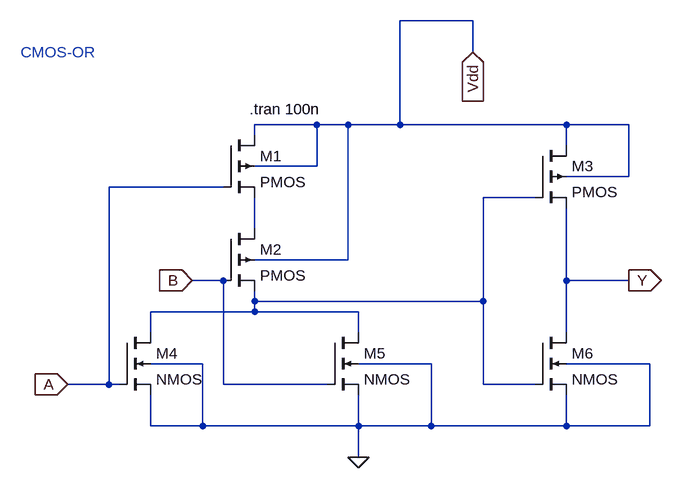
[diagram p0: schematic CMOS_or.asc]
CMOS_or.asc, the LTspice schematic file:
Version 4
SHEET 1 992 680
WIRE 656 -48 544 -48
WIRE 656 0 656 -48
WIRE 416 112 320 112
WIRE 464 112 416 112
WIRE 544 112 544 -48
WIRE 544 112 464 112
WIRE 800 112 544 112
WIRE 896 112 800 112
WIRE 320 128 320 112
WIRE 800 144 800 112
WIRE 416 176 416 112
WIRE 416 176 320 176
WIRE 896 192 896 112
WIRE 896 192 800 192
WIRE 272 208 96 208
WIRE 752 224 672 224
WIRE 320 272 320 224
WIRE 464 320 464 112
WIRE 464 320 320 320
WIRE 272 352 224 352
WIRE 800 352 800 240
WIRE 896 352 800 352
WIRE 320 384 320 368
WIRE 672 384 672 224
WIRE 672 384 320 384
WIRE 320 400 320 384
WIRE 320 400 160 400
WIRE 480 400 320 400
WIRE 160 432 160 400
WIRE 480 432 480 400
WIRE 800 432 800 352
WIRE 240 480 160 480
WIRE 592 480 480 480
WIRE 928 480 800 480
WIRE 96 512 96 208
WIRE 96 512 32 512
WIRE 112 512 96 512
WIRE 272 512 272 352
WIRE 432 512 272 512
WIRE 672 512 672 384
WIRE 752 512 672 512
WIRE 160 576 160 528
WIRE 240 576 240 480
WIRE 240 576 160 576
WIRE 480 576 480 528
WIRE 480 576 240 576
WIRE 592 576 592 480
WIRE 592 576 480 576
WIRE 800 576 800 528
WIRE 800 576 592 576
WIRE 928 576 928 480
WIRE 928 576 800 576
WIRE 480 624 480 576
FLAG 480 624 0
FLAG 32 512 A
IOPIN 32 512 In
FLAG 224 352 B
IOPIN 224 352 In
FLAG 896 352 Y
IOPIN 896 352 Out
FLAG 656 0 Vdd
IOPIN 656 0 In
SYMBOL pmos4 272 128 R0
SYMATTR InstName M1
SYMBOL pmos4 272 272 R0
SYMATTR InstName M2
SYMBOL pmos4 752 144 R0
SYMATTR InstName M3
SYMBOL nmos4 112 432 R0
SYMATTR InstName M4
SYMBOL nmos4 432 432 R0
SYMATTR InstName M5
SYMBOL nmos4 752 432 R0
SYMATTR InstName M6
TEXT -40 0 Left 2 ;CMOS-OR
TEXT 312 88 Left 2 !.tran 100n

The netlist it stands for:
* CMOS_or.asc
M1 Vdd A N002 Vdd PMOS
M2 N002 B N001 Vdd PMOS
M3 Vdd N001 Y Vdd PMOS
M4 N001 A 0 0 NMOS
M5 N001 B 0 0 NMOS
M6 Y N001 0 0 NMOS
.model NMOS NMOS
.model PMOS PMOS
.lib standard.mos
* CMOS-OR
.tran 100n
.backanno
.end